# Altium schematic sheet GAT562 Mesh Tracker Pro.SchDoc
size A3
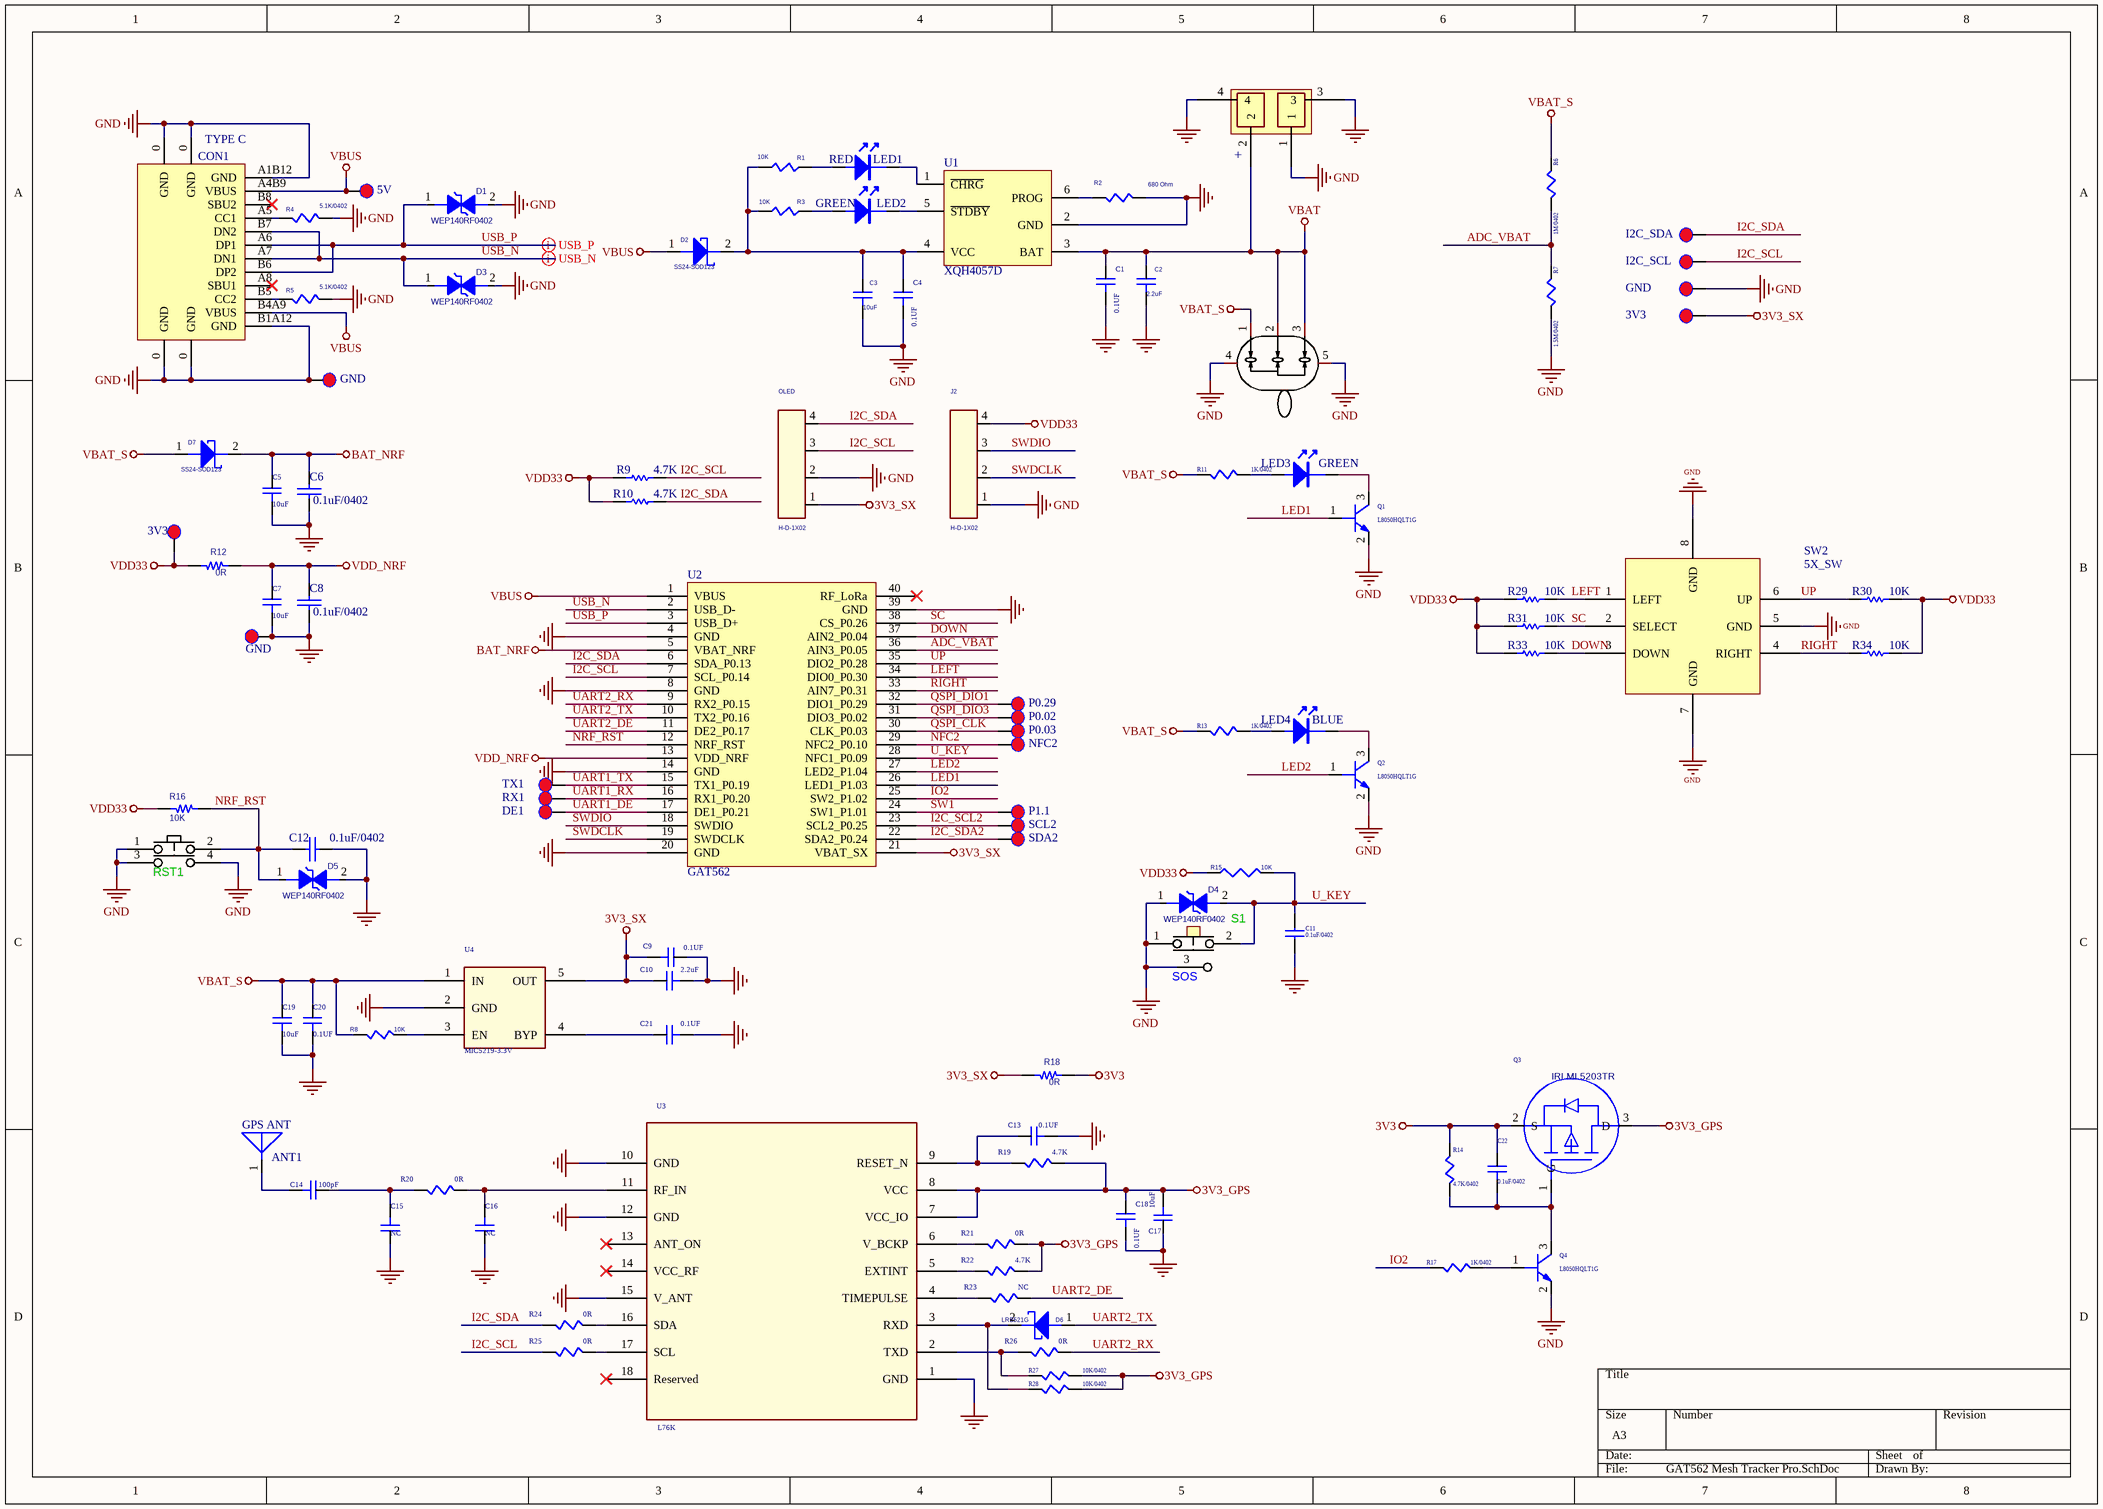
[diagram p0: GAT562 Mesh Tracker Pro.SchDoc]

## Parts
(Parts that share a designator on the sheet are numbered #1, #2 ... from top to bottom, then left to right.)
3V3#1  (no value)  [PAD_29mil]  (no BOM)
3V3#2  (no value)  [PAD_29mil]  (no BOM)
5V  (no value)  [PAD_29mil]  (no BOM)
ANT1  GPS ANT  [GPS1818]
BAT1  H1  [125T-2P]  (value not drawn)
C1  0.1UF  [C0402]
C2  2.2uF  [C0402]
C3  10uF  [C0402]
C4  0.1UF  [C0402]
C5  10uF  [C0402]
C6  0.1uF/0402  [C0402]
C7  10uF  [C0402]
C8  0.1uF/0402  [C0402]
C9  0.1UF  [C0402]
C10  2.2uF  [C0402]
C11  0.1uF/0402  [C0402]
C12  0.1uF/0402  [C0402]
C13  0.1UF  [C0402]
C14  100pF  [C0402]
C15  NC  [C0402]
C16  NC  [C0402]
C17  10uF  [C0402]
C18  0.1UF  [C0402]
C19  10uF  [C0402]
C20  0.1UF  [C0402]
C21  0.1UF  [C0402]
C22  0.1uF/0402  [C0402]
CON1  TYPE C  [TYPE C 12]
D1  WEP140RF0402  [ESD0402]
D2  SS24-SOD123  [SOD-123-1]
D3  WEP140RF0402  [ESD0402]
D4  WEP140RF0402  [ESD0402]
D5  WEP140RF0402  [ESD0402]
D6  LRB521G  [SOD723]
D7  SS24-SOD123  [SOD-123-1]
DE1  (no value)  [PAD_29mil]  (no BOM)
GND#1  (no value)  [PAD_29mil]  (no BOM)
GND#2  (no value)  [PAD_29mil]  (no BOM)
GND#3  (no value)  [PAD_29mil]  (no BOM)
I2C_SCL  (no value)  [PAD_29mil]  (no BOM)
I2C_SDA  (no value)  [PAD_29mil]  (no BOM)
J2  H-D-1X02  [HDR1X4-2.0]
LED1  RED  [LED0603_RED_3D]
LED2  GREEN  [LED0603_RED_3D]
LED3  GREEN  [LED0603_RED_3D]
LED4  BLUE  [LED0603_RED_3D]
NFC2  (no value)  [PAD_29mil]  (no BOM)
OLED  H-D-1X02  [OLED 1.3 4P]
P0.02  (no value)  [PAD_29mil]  (no BOM)
P0.03  (no value)  [PAD_29mil]  (no BOM)
P0.29  (no value)  [PAD_29mil]  (no BOM)
P1.1  (no value)  [PAD_29mil]  (no BOM)
Q1  L8050HQLT1G  [SOT23]
Q2  L8050HQLT1G  [SOT23]
Q3  IRLML5203TR  [SOT23]
Q4  L8050HQLT1G  [SOT23]
R1  10K  [R0402]
R2  680 Ohm  [R0402]
R3  10K  [R0402]
R4  5.1K/0402  [R0402]
R5  5.1K/0402  [R0402]
R6  1M/0402  [R0402]
R7  1.5M/0402  [R0402]
R8  10K  [R0402]
R9  4.7K  [X0402R_3D]
R10  4.7K  [X0402R_3D]
R11  1K/0402  [R0402]
R12  0R  [R0402]
R13  1K/0402  [R0402]
R14  4.7K/0402  [R0402]
R15  10K  [R0402]
R16  10K  [R0402]
R17  1K/0402  [R0402]
R18  0R  [R0402]
R19  4.7K  [R0402]
R20  0R  [R0402]
R21  0R  [R0402]
R22  4.7K  [R0402]
R23  NC  [R0402]
R24  0R  [R0402]
R25  0R  [R0402]
R26  0R  [R0402]
R27  10K/0402  [R0402]
R28  10K/0402  [R0402]
R29  10K  [X0402R_3D]
R30  10K  [X0402R_3D]
R31  10K  [X0402R_3D]
R33  10K  [X0402R_3D]
R34  10K  [X0402R_3D]
RST1  KEY1  [SMDPUSHBUTTON4X2X3_5]  (value not drawn)
RX1  (no value)  [PAD_29mil]  (no BOM)
S1  SOS  [SW-TH_3P-L4.5]
SCL2  (no value)  [PAD_29mil]  (no BOM)
SDA2  (no value)  [PAD_29mil]  (no BOM)
SW1  SK12D07VG4  [SW-TH_SK12D07VG4]  (value not drawn)
SW2  5X_SW  [5X_SW 7*7*6]
TX1  (no value)  [PAD_29mil]  (no BOM)
U1  XQH4057D  [XQH4057D]
U2  GAT562  [GAT562]
U3  L76K  [MAX-7]
U4  MIC5219-3.3V  [SOT23-5]

## Nets
3V3: C22.1 Q3.2(S) R14.2 R18.2
3V3_GPS: C17.2 C18.1 Q3.3(D) R19.1 R21.1 R22.1 R27.1 R28.1 U3.7(VCC_IO) U3.8(VCC)
3V3_SX: 3V3#1.1 C9.2 C10.1 OLED.1 R18.1 U2.21(VBAT_SX) U4.5(OUT)
BAT_NRF: C5.1 C6.2 D7.2(CATHODE) U2.5(VBAT_NRF)
GND: BAT1.1 BAT1.3 BAT1.4 C1.2 C2.2 C3.2 C4.2 C5.2 C6.1 C7.2 C8.1 C9.1 C10.2 C11.2 C12.1 C13.2 C15.1 C16.1 C17.1 C18.2 C19.2 C20.2 C21.2 CON1.0(GND) CON1.A1B12(GND) CON1.B1A12(GND) D1.2(CATHODE) D3.2(CATHODE) D4.1(ANODE) D5.2(CATHODE) GND#1.1 GND#2.1 GND#3.1 J2.1 OLED.2 Q1.2(Emitter) Q2.2(Emitter) Q4.2(Emitter) R2.2 R4.2 R5.2 R7.1 RST1.1 RST1.3 RST1.4 S1.1 S1.3 SW1.4 SW1.5 SW2.5(GND) SW2.7(GND) SW2.8(GND) U1.2(GND) U2.4(GND) U2.8(GND) U2.14(GND) U2.20(GND) U2.39(GND) U3.1(GND) U3.10(GND) U3.12(GND) U3.15(V_ANT) U4.2(GND)
VBAT: BAT1.2 C1.1 C2.1 SW1.2 SW1.3 U1.3(BAT)
VBAT_S: C19.1 C20.1 D7.1(ANODE) R6.2 R8.1 R11.2 R13.2 SW1.1 U4.1(IN)
VBUS: 5V.1 CON1.A4B9(VBUS) CON1.B4A9(VBUS) D2.1(ANODE) U2.1(VBUS)
VDD33: 3V3#2.1 J2.4 R9.1 R10.2 R12.1 R15.1 R16.1 R29.1 R30.2 R31.1 R33.1 R34.2
VDD_NRF: C7.1 C8.2 R12.2 U2.13(VDD_NRF)
ADC_VBAT: R6.1 R7.2 U2.36(AIN3_P0.05)
DOWN: R33.2 SW2.3(DOWN) U2.37(AIN2_P0.04)
I2C_SCL: I2C_SCL.1 OLED.3 R9.2 R25.2 U2.7(SCL_P0.14)
I2C_SCL2: SCL2.1 U2.23(SCL2_P0.25)
I2C_SDA: I2C_SDA.1 OLED.4 R10.1 R24.2 U2.6(SDA_P0.13)
I2C_SDA2: SDA2.1 U2.22(SDA2_P0.24)
IO2: R17.2 U2.25(SW2_P1.02)
LED1: Q1.1(Base) U2.26(LED1_P1.03)
LED2: Q2.1(Base) U2.27(LED2_P1.04)
LEFT: R29.2 SW2.1(LEFT) U2.34(DIO0_P0.30)
NFC2: NFC2.1 U2.29(NFC2_P0.10)
NRF_RST: C12.2 D5.1(ANODE) R16.2 RST1.2 U2.12(NRF_RST)
QSPI_CLK: P0.03.1 U2.30(CLK_P0.03)
QSPI_DIO1: P0.29.1 U2.32(DIO1_P0.29)
QSPI_DIO3: P0.02.1 U2.31(DIO3_P0.02)
RIGHT: R34.1 SW2.4(RIGHT) U2.33(AIN7_P0.31)
SC: R31.2 SW2.2(SELECT) U2.38(CS_P0.26)
SW1: P1.1.1 U2.24(SW1_P1.01)
SWDCLK: J2.2 U2.19(SWDCLK)
SWDIO: J2.3 U2.18(SWDIO)
U_KEY: C11.1 D4.2(CATHODE) R15.2 S1.2 U2.28(NFC1_P0.09)
UART1_DE: DE1.1 U2.17(DE1_P0.21)
UART1_RX: RX1.1 U2.16(RX1_P0.20)
UART1_TX: TX1.1 U2.15(TX1_P0.19)
UART2_DE: R23.1 U2.11(DE2_P0.17)
UART2_RX: R26.1 U2.9(RX2_P0.15)
UART2_TX: D6.1(ANODE) U2.10(TX2_P0.16)
UP: R30.1 SW2.6(UP) U2.35(DIO2_P0.28)
USB_N: CON1.A7(DN1) CON1.B7(DN2) D3.1(ANODE) U2.2(USB_D-)
USB_P: CON1.A6(DP1) CON1.B6(DP2) D1.1(ANODE) U2.3(USB_D+)
NetANT1_1: ANT1.1(FEED) C14.2
NetC3_1: C3.1 C4.1 D2.2(CATHODE) R1.2 R3.2 U1.4(VCC)
NetC13_1: C13.1 R19.2 U3.9(RESET_N)
NetC14_1: C14.1 C15.2 R20.2
NetC16_2: C16.2 R20.1 U3.11(RF_IN)
NetC21_1: C21.1 U4.4(BYP)
NetC22_2: C22.2 Q3.1(G) Q4.3(Collector) R14.1
NetCON1_A5: CON1.A5(CC1) R4.1
NetCON1_B5: CON1.B5(CC2) R5.1
NetD6_2: D6.2(CATHODE) R28.2 U3.3(RXD)
NetLED1_1: LED1.1 R1.1
NetLED1_2: LED1.2 U1.1(~{CHRG})
NetLED2_1: LED2.1 R3.1
NetLED2_2: LED2.2 U1.5(~{STDBY})
NetLED3_1: LED3.1 R11.1
NetLED3_2: LED3.2 Q1.3(Collector)
NetLED4_1: LED4.1 R13.1
NetLED4_2: LED4.2 Q2.3(Collector)
NetQ4_1: Q4.1(Base) R17.1
NetR2_1: R2.1 U1.6(PROG)
NetR8_2: R8.2 U4.3(EN)
NetR21_2: R21.2 U3.6(V_BCKP)
NetR22_2: R22.2 U3.5(EXTINT)
NetR23_2: R23.2 U3.4(TIMEPULSE)
NetR24_1: R24.1 U3.16(SDA)
NetR25_1: R25.1 U3.17(SCL)
NetR26_2: R26.2 R27.2 U3.2(TXD)

Not connected (* = marked no-connect by the designer): CON1 A8(SBU1)* B8(SBU2)*; U2 40(RF_LoRa)*; U3 13(ANT_ON)* 14(VCC_RF)* 18(Reserved)*

## Layout directives
differential pair: USB_N, USB_P

## Notes on the sheet
- (near BAT1) +

## Library data of the parts
3V3#1 3V3#2 5V DE1 GND#1-GND#3 I2C_SCL I2C_SDA NFC2 P0.02 P0.03 P0.29 P1.1 RX1 SCL2 SDA2 TX1 = TEST-DOT
ANT1 = ANTENNA-2_1
BAT1 = 2P BAT
C1 C4 C5 C7 C9 C10 C13-C21 = 0_1.1UF
C2 C3 C22 = 0.1UF
C6 C8 C12 = CAP: Capacitor
C11 = C0402-100n: Capacitor, X7R, ?0%; Note: 16V; Artikkelnr Noca: 20039200; Artikkelnr Simpro: N.A.; Part Number: C0402-100n; Manufacturer: *; Manufacturer Part Number: *; Datasheet: *; LatestRevisionDate: 2009-11-23; Pin Count: 2; Publisher: Nordic Semiconductor; Published: 2009-05-08; Value: 0.1uF/0402; Supplier: *; Supplier part number: *; 2nd source Supplier: *; 2nd source part number: *; Footprint Doc: 0402
CON1 = TYPE C: MODE:U262-161N-4BVC11/C319148
D1 D3-D5 = DIODE SCHOTTKY_1
D2 D6 D7 = DIODE SCHOTTKY_0: DIODE 1N5817,DIP, 20V, 1A; Vendor PN: SBR3A40SA; Vendor: DIODES Incorporated.; Package: SMA
J2 OLED = CON6_1_Dup1
LED1-LED4 = LED
Q1 Q2 Q4 = 1R1001_0
Q3 = FETP-GSD_0: PARTS: 1; OriginalSymbolOrigin: (0,0); LEVEL: STD; %208%%161%%192%%224%%195%%251%%179%%198%: MOSFET; COMPONENT_HIGH_MAX: 1.12MM; %195%%232%%202%%246%: MOSFET-P沟道--30V--3A-98MOHM--20V-SOT23; CODE: 15060138; PKG_TYPE: SOT23
R1-R8 R11 R13 R14 R17 R19-R28 = R0402_1.06K_WALSIN: VENDER\PN: WALSIN\WR04X8061FT; NO_STUFF: .
R9 R10 R29-R31 R33 R34 = Res1: Resistor; Published: 8-Jun-2000; LatestRevisionDate: 17-Jul-2002; LatestRevisionNote: Re-released for DXP Platform.; PackageReference: AXIAL-0.3; Publisher: Altium Limited
  R9 R10: Value: 4.7K
  R29-R31 R33 R34: Value: 10K
R12 R16 R18 = RES: Resistor , 2K Ohm 0402  5%
R15 = R_2: Part Number: S; Tolerance: 1%
S1 = KEY2-3: 编号: C455252,插件件,4.5x4.5mm
SW1 = SK12D07VG4: 编号: C393937,关高度: 8.8mm; Manufacturer: G-Switch(品赞); Name: MK-12C03-G015; Add into BOM: yes; Current Rating (DC): 1A; Voltage Rating (DC): 6V; Circuit: 单刀双掷; Mechanical Life: 10000; Actuator Color: 白色; Actuator Style: 矩形柱状; Pin Style: SMD接片; Switch Length: 6.65mm; Switch Width: 2.75mm; Switch Height: 4.25mm; Symbol: SK12D07VG4; Device: SK12D07VG4; LCSC Part Name: 3脚拨动开关 P=2mm; Supplier Part: C393937; Manufacturer Part: MK-12C03-G015; Supplier Footprint: SMD; JLCPCB Part Class: Extended Part; Datasheet: https://atta.szlcsc.com/upload/public/pdf/source/20210903/D741BE8374CE854DD630D54FFF9BD91E.pdf; Supplier: LCSC; Convert to PCB: yes; Mounting Style: 卧贴; Operating Temperature: -20℃~+70℃
SW2 = 5X_SW: 5X_SW 7*7*6
U3 = MAX-7
U4 = REG CAT7101_2